# Altium schematic sheet SEX.SchDoc
size A; SheetNumber: 4; SheetTotal: 4
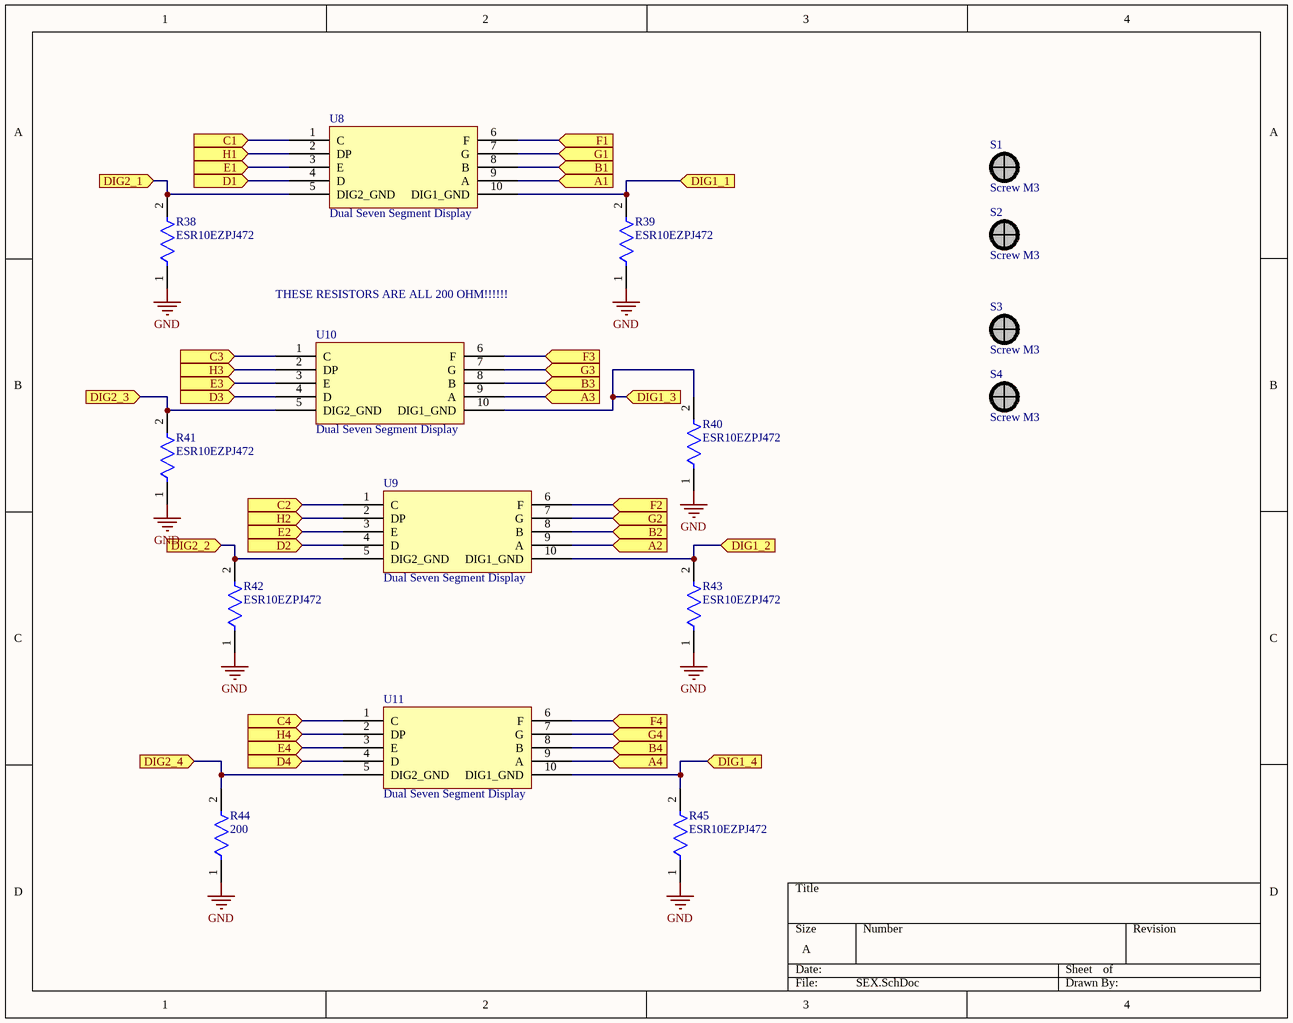
[diagram p0: SEX.SchDoc]

## Parts
R38  ESR10EZPJ472  [FP-ESR10-IPC_B]
R39  ESR10EZPJ472  [FP-ESR10-IPC_B]
R40  ESR10EZPJ472  [FP-ESR10-IPC_B]
R41  ESR10EZPJ472  [FP-ESR10-IPC_B]
R42  ESR10EZPJ472  [FP-ESR10-IPC_B]
R43  ESR10EZPJ472  [FP-ESR10-IPC_B]
R44  200  [FP-ESR10-IPC_B]
R45  ESR10EZPJ472  [FP-ESR10-IPC_B]
S1  Screw M3  [Screw M3]
S2  Screw M3  [Screw M3]
S3  Screw M3  [Screw M3]
S4  Screw M3  [Screw M3]
U8  Dual Seven Segment Display  [DIP10]
U9  Dual Seven Segment Display  [DIP10]
U10  Dual Seven Segment Display  [DIP10]
U11  Dual Seven Segment Display  [DIP10]

## Ports
A1 (in, see ssegs_and_registers[2A]), A2 (in, see ssegs_and_registers[2B]), A3 (in, see ssegs_and_registers[4A]), A4 (in, see ssegs_and_registers[4B]), B1 (in, see ssegs_and_registers[2A]), B2 (in, see ssegs_and_registers[2C]), B3 (in, see ssegs_and_registers[4A]), B4 (in, see ssegs_and_registers[4C]), C1 (in, see ssegs_and_registers[2A]), C2 (in, see ssegs_and_registers[2C]), C3 (in, see ssegs_and_registers[4A]), C4 (in, see ssegs_and_registers[4C]), D1 (in, see ssegs_and_registers[2A]), D2 (in, see ssegs_and_registers[2C]), D3 (in, see ssegs_and_registers[4A]), D4 (in, see ssegs_and_registers[4C]), DIG1_1 (in, see frontbreakoutSchematic[2A]), DIG1_2 (in, see frontbreakoutSchematic[2A]), DIG1_3 (in, see frontbreakoutSchematic[2A]), DIG1_4 (in, see frontbreakoutSchematic[2A]), DIG2_1 (in, see frontbreakoutSchematic[2A]), DIG2_2 (in, see frontbreakoutSchematic[2A]), DIG2_3 (in, see frontbreakoutSchematic[2A]), DIG2_4 (in, see frontbreakoutSchematic[2B]), E1 (in, see ssegs_and_registers[2A]), E2 (in, see ssegs_and_registers[2C]), E3 (in, see ssegs_and_registers[4A]), E4 (in, see ssegs_and_registers[4C]), F1 (in, see ssegs_and_registers[2A]), F2 (in, see ssegs_and_registers[2C]), F3 (in, see ssegs_and_registers[4A]), F4 (in, see ssegs_and_registers[4C]), G1 (in, see ssegs_and_registers[2A]), G2 (in, see ssegs_and_registers[2C]), G3 (in, see ssegs_and_registers[4A]), G4 (in, see ssegs_and_registers[4C]), H1 (in, see ssegs_and_registers[2B]), H2 (in, see ssegs_and_registers[2C]), H3 (in, see ssegs_and_registers[4B]), H4 (in, see ssegs_and_registers[4C])

## Nets
GND: R38.1 R39.1 R40.1 R41.1 R42.1 R43.1 R44.1 R45.1
A1: U8.9(A) ; port A1
A2: U9.9(A) ; port A2
A3: U10.9(A) ; port A3
A4: U11.9(A) ; port A4
B1: U8.8(B) ; port B1
B2: U9.8(B) ; port B2
B3: U10.8(B) ; port B3
B4: U11.8(B) ; port B4
C1: U8.1(C) ; port C1
C2: U9.1(C) ; port C2
C3: U10.1(C) ; port C3
C4: U11.1(C) ; port C4
D1: U8.4(D) ; port D1
D2: U9.4(D) ; port D2
D3: U10.4(D) ; port D3
D4: U11.4(D) ; port D4
DIG1_1: R39.2 U8.10(DIG1_GND) ; port DIG1_1
DIG1_2: R43.2 U9.10(DIG1_GND) ; port DIG1_2
DIG1_3: R40.2 U10.10(DIG1_GND) ; port DIG1_3
DIG1_4: R45.2 U11.10(DIG1_GND) ; port DIG1_4
DIG2_1: R38.2 U8.5(DIG2_GND) ; port DIG2_1
DIG2_2: R42.2 U9.5(DIG2_GND) ; port DIG2_2
DIG2_3: R41.2 U10.5(DIG2_GND) ; port DIG2_3
DIG2_4: R44.2 U11.5(DIG2_GND) ; port DIG2_4
E1: U8.3(E) ; port E1
E2: U9.3(E) ; port E2
E3: U10.3(E) ; port E3
E4: U11.3(E) ; port E4
F1: U8.6(F) ; port F1
F2: U9.6(F) ; port F2
F3: U10.6(F) ; port F3
F4: U11.6(F) ; port F4
G1: U8.7(G) ; port G1
G2: U9.7(G) ; port G2
G3: U10.7(G) ; port G3
G4: U11.7(G) ; port G4
H1: U8.2(DP) ; port H1
H2: U9.2(DP) ; port H2
H3: U10.2(DP) ; port H3
H4: U11.2(DP) ; port H4

## Notes on the sheet
- THESE RESISTORS ARE ALL 200 OHM!!!!!!

## Library data of the parts
R38-R45 = CMP-08839-001245-1: 4.7kΩ ±5% 0.4W 0805 Anti-Surge Chip Resistor AEC-Q200; Resistance: 4.7kR; Power Rating: 400mW; Temperature Coefficient: 200ppm/°C; Size Code: 0805; Lead Free: Lead Free; Max Power Dissipation: 400mW; Case/Package: 0805; Number of Terminations: 2; Features: Automotive AEC-Q200; Case Code (Imperial): 0805; RoHS Compliant: Yes; Tolerance: 5%; Packaging: Tape and Reel; Case Code (Metric): 2012; Series: ESR
U8-U11 = Component_1